# Altium schematic sheet 升降电机驱动.SchDoc
size A4
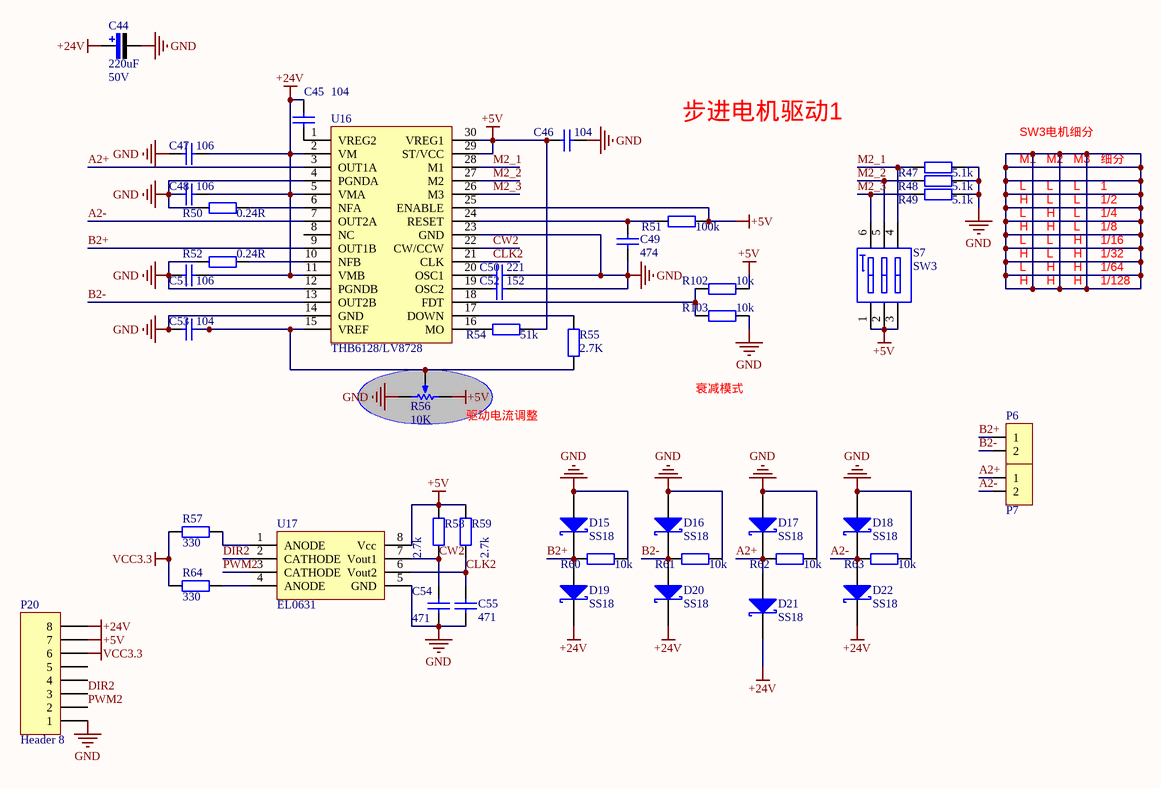
[diagram p0: 升降电机驱动.SchDoc]

## Parts
C44  value 220uF  Vol: 50V  [C-RB-S10]  (hidden comment: Cap Pol)
C45  value 104  [C-RAD-0603]  (hidden comment: Cap)
C46  value 104  [C-RAD-0603]  (hidden comment: Cap)
C47  value 106  [C-RAD-0603]  (hidden comment: Cap)
C48  value 106  [C-RAD-0603]  (hidden comment: Cap)
C49  value 474  [C-RAD-0603]  (hidden comment: Cap)
C50  value 221  [C-RAD-0603]  (hidden comment: Cap)
C51  value 106  [C-RAD-0603]  (hidden comment: Cap)
C52  value 152  [C-RAD-0603]  (hidden comment: Cap)
C53  value 104  [C-RAD-0603]  (hidden comment: Cap)
C54  value 471  [C-RAD-0603]  (hidden comment: Cap)
C55  value 471  [C-RAD-0603]  (hidden comment: Cap)
D15  Type: SS18  [DIODE-SMA]  (hidden comment: D-Schottky)
D16  Type: SS18  [DIODE-SMA]  (hidden comment: D-Schottky)
D17  Type: SS18  [DIODE-SMA]  (hidden comment: D-Schottky)
D18  Type: SS18  [DIODE-SMA]  (hidden comment: D-Schottky)
D19  Type: SS18  [DIODE-SMA]  (hidden comment: D-Schottky)
D20  Type: SS18  [DIODE-SMA]  (hidden comment: D-Schottky)
D21  Type: SS18  [DIODE-SMA]  (hidden comment: D-Schottky)
D22  Type: SS18  [DIODE-SMA]  (hidden comment: D-Schottky)
P6  cnt2p  [接线端子5mm间距2p]  (value not drawn)
P7  cnt2p  [接线端子5mm间距2p]  (value not drawn)
P20  Header 8  [PH2.0-8P]
R47  value 5.1k  [0603-1]  (hidden comment: Res1)
R48  value 5.1k  [0603-1]  (hidden comment: Res1)
R49  value 5.1k  [0603-1]  (hidden comment: Res1)
R50  value 0.24R  [2512]  (hidden comment: Res1)
R51  value 100k  [0603-1]  (hidden comment: Res1)
R52  value 0.24R  [2512]  (hidden comment: Res1)
R54  value 51k  [0603-1]  (hidden comment: Res1)
R55  value 2.7K  [0603-1]  (hidden comment: Res1)
R56  value 10K  [VR-3266W]  (hidden comment: RPot)
R57  value 330  [0603-1]  (hidden comment: Res1)
R58  value 2.7k  [0603-1]  (hidden comment: Res1)
R59  value 2.7k  [0603-1]  (hidden comment: Res1)
R60  value 10k  [0603-1]  (hidden comment: Res1)
R61  value 10k  [0603-1]  (hidden comment: Res1)
R62  value 10k  [0603-1]  (hidden comment: Res1)
R63  value 10k  [0603-1]  (hidden comment: Res1)
R64  value 330  [0603-1]  (hidden comment: Res1)
R102  value 10k  [0603-1]  (hidden comment: Res1)
R103  value 10k  [0603-1]  (hidden comment: Res1)
S7  SW3  [SW6_3BIT]
U16  THB6128/LV8728  [SIOC-30-W]
U17  EL0631  [EL0631]

## Nets
+5V: C46.1 P20.7 R51.2 R54.2 R56.1(TOP) R58.2 R59.2 R102.2 S7.1 S7.2 S7.3 U16.25(ENABLE) U16.29(ST/VCC) U16.30(VREG1) U17.8(Vcc)
+24V: C44.1 C45.1 C47.2 C48.2 C51.2 D19.2(K) D20.2(K) D21.2(K) D22.2(K) P20.8 U16.2(VM) U16.5(VMA) U16.11(VMB)
GND: C44.2 C46.2 C47.1 C48.1 C49.1 C50.2 C51.1 C52.2 C53.1 C54.1 C55.1 D15.1(A) D16.1(A) D17.1(A) D18.1(A) P20.1 R47.2 R48.2 R49.2 R50.1 R52.2 R56.3(BOT) R60.2 R61.2 R62.2 R63.2 R103.2 U16.4(PGNDA) U16.12(PGNDB) U16.14(GND) U16.23(GND) U17.5(GND)
VCC3.3: P20.6 R57.2 R64.2
A2+: D17.2(K) D21.1(A) P7.1 R62.1 U16.3(OUT1A)
A2-: D18.2(K) D22.1(A) P7.2 R63.1 U16.7(OUT2A)
B2+: D15.2(K) D19.1(A) P6.1 R60.1 U16.9(OUT1B)
B2-: D16.2(K) D20.1(A) P6.2 R61.1 U16.13(OUT2B)
CLK2: C55.2 R59.1 U16.21(CLK) U17.6(Vout2)
CW2: C54.2 R58.1 U16.22(CW/CCW) U17.7(Vout1)
DIR2: P20.3 U17.2(CATHODE)
M2_1: R47.1 S7.4 U16.28(M1)
M2_2: R48.1 S7.5 U16.27(M2)
M2_3: R49.1 S7.6 U16.26(M3)
PWM2: P20.2 U17.3(CATHODE)
NetC45_2: C45.2 U16.1(VREG2)
NetC49_2: C49.2 R51.1 U16.24(RESET)
NetC50_1: C50.1 U16.20(OSC1)
NetC52_1: C52.1 U16.19(OSC2)
NetC53_2: C53.2 R55.2 R56.2(TAP) U16.15(VREF)
NetR50_2: R50.2 U16.6(NFA)
NetR52_1: R52.1 U16.10(NFB)
NetR54_1: R54.1 U16.16(MO)
NetR55_1: R55.1 U16.17(DOWN)
NetR57_1: R57.1 U17.1(ANODE)
NetR64_1: R64.1 U17.4(ANODE)
NetR102_1: R102.1 R103.1 U16.18(FDT)

Not connected (* = marked no-connect by the designer): P20 4 5; U16 8(NC)

## Notes on the sheet
- 步进电机驱动1
- M1
- L
- SW3电机细分
- M2
- M3
- 细分
- 1
- H
- 1/2
- 1/4
- 1/8
- 1/16
- 1/32
- 1/64
- 1/128
- 衰减模式
- (near R56) 驱动电流调整

## Library data of the parts
C44 = Cap Pol: 极性电解电容; Published: 8-Jun-2000; LatestRevisionDate: 17-Jul-2002; LatestRevisionNote: Re-released for DXP Platform.; PackageReference: RB7.6-15; Publisher: Altium Limited
C45-C55 = Cap: 无极性电容; Published: 8-Jun-2000; LatestRevisionDate: 17-Jul-2002; LatestRevisionNote: Re-released for DXP Platform.; PackageReference: RAD-0.3; Publisher: Altium Limited
D15-D22 = D-Schottky: 肖特基二极管; Published: 8-Jun-2000; LatestRevisionDate: 17-Jul-2002; LatestRevisionNote: Re-released for DXP Platform.; PackageReference: SMB; Publisher: Altium Limited; Code_JEDEC: DO-214-AA
P20 = Header 8: Header, 8-Pin; LatestRevisionDate: 17-Jul-2002; LatestRevisionNote: Re-released for DXP Platform.; Publisher: Altium Limited
R47-R52 R54 R55 R57-R64 R102 R103 = Res1: 贴片电阻; Published: 8-Jun-2000; LatestRevisionDate: 17-Jul-2002; LatestRevisionNote: Re-released for DXP Platform.; PackageReference: AXIAL-0.4; Publisher: Altium Limited
R56 = RPot: 精密可调电阻; Sim Note: Enter the Resistance value and the set point into parameter fields.; Set Position: 0.5; Published: 8-Jun-2000; LatestRevisionDate: 17-Jul-2002; LatestRevisionNote: Re-released for DXP Platform.; PackageReference: VR5; Publisher: Altium Limited
S7 = SW3: 3位编码开关
U16 = THB6128: 步进电机驱动
U17 = EL0631: 双路隔离光耦